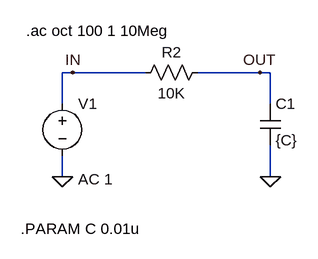
[diagram p0: schematic Fig_6-8_AC_RC_LowPass_0u01.asc]
Fig_6-8_AC_RC_LowPass_0u01.asc, the LTspice schematic file:
Version 4
SHEET 1 880 680
WIRE 192 80 176 80
WIRE 304 80 192 80
WIRE 480 80 384 80
WIRE 496 80 480 80
WIRE 176 128 176 80
WIRE 496 128 496 80
WIRE 176 240 176 208
WIRE 496 240 496 192
FLAG 176 240 0
FLAG 496 240 0
FLAG 480 80 OUT
FLAG 192 80 IN
SYMBOL cap 480 192 M180
WINDOW 0 24 64 Left 2
WINDOW 3 24 8 Left 2
SYMATTR InstName C1
SYMATTR Value {C}
SYMBOL res 288 96 R270
WINDOW 0 32 56 VTop 2
WINDOW 3 0 56 VBottom 2
SYMATTR InstName R2
SYMATTR Value 10K
SYMBOL voltage 176 112 R0
WINDOW 123 24 132 Left 2
WINDOW 39 0 0 Left 2
SYMATTR Value2 AC 1
SYMATTR InstName V1
SYMATTR Value ""
TEXT 120 16 Left 2 !.ac oct 100 1 10Meg
TEXT 112 320 Left 2 !.PARAM C 0.01u

The netlist it stands for:
* Fig_6-8_AC_RC_LowPass_0u01.asc
C1 0 OUT {C}
R2 IN OUT 10K
V1 IN 0 AC 1
.ac oct 100 1 10Meg
.PARAM C 0.01u
.backanno
.end